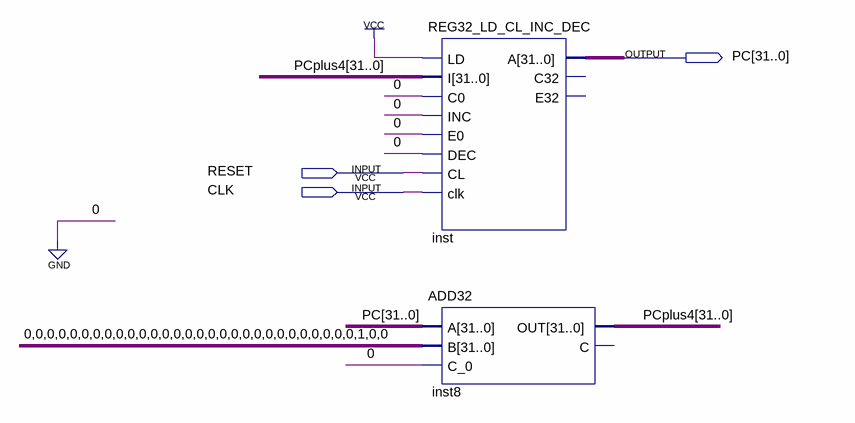
[diagram p0: schematic sheet]
// Quartus schematic pc.bdf as structural Verilog: 2 symbols, 3 pins
module pc (
  input  RESET,
  input  CLK,
  output [31:0] PC
);

  wire \1 ;
  wire [31:0] PCplus4;

  REG32_LD_CL_INC_DEC inst (
    .LD(1'b1), .I(PCplus4), .C0(1'b0), .INC(1'b0), .E0(1'b0), .DEC(1'b0), .CL(RESET), .clk(CLK), .A(PC));  // open: C32, E32
  ADD32 inst8 (.A(PC), .B({{29{1'b0}}, \1 , 2'b00}), .C_0(1'b0), .OUT(PCplus4));  // open: C
endmodule
